# EAGLE schematic SingleSystem (EAGLE 7.5.0)
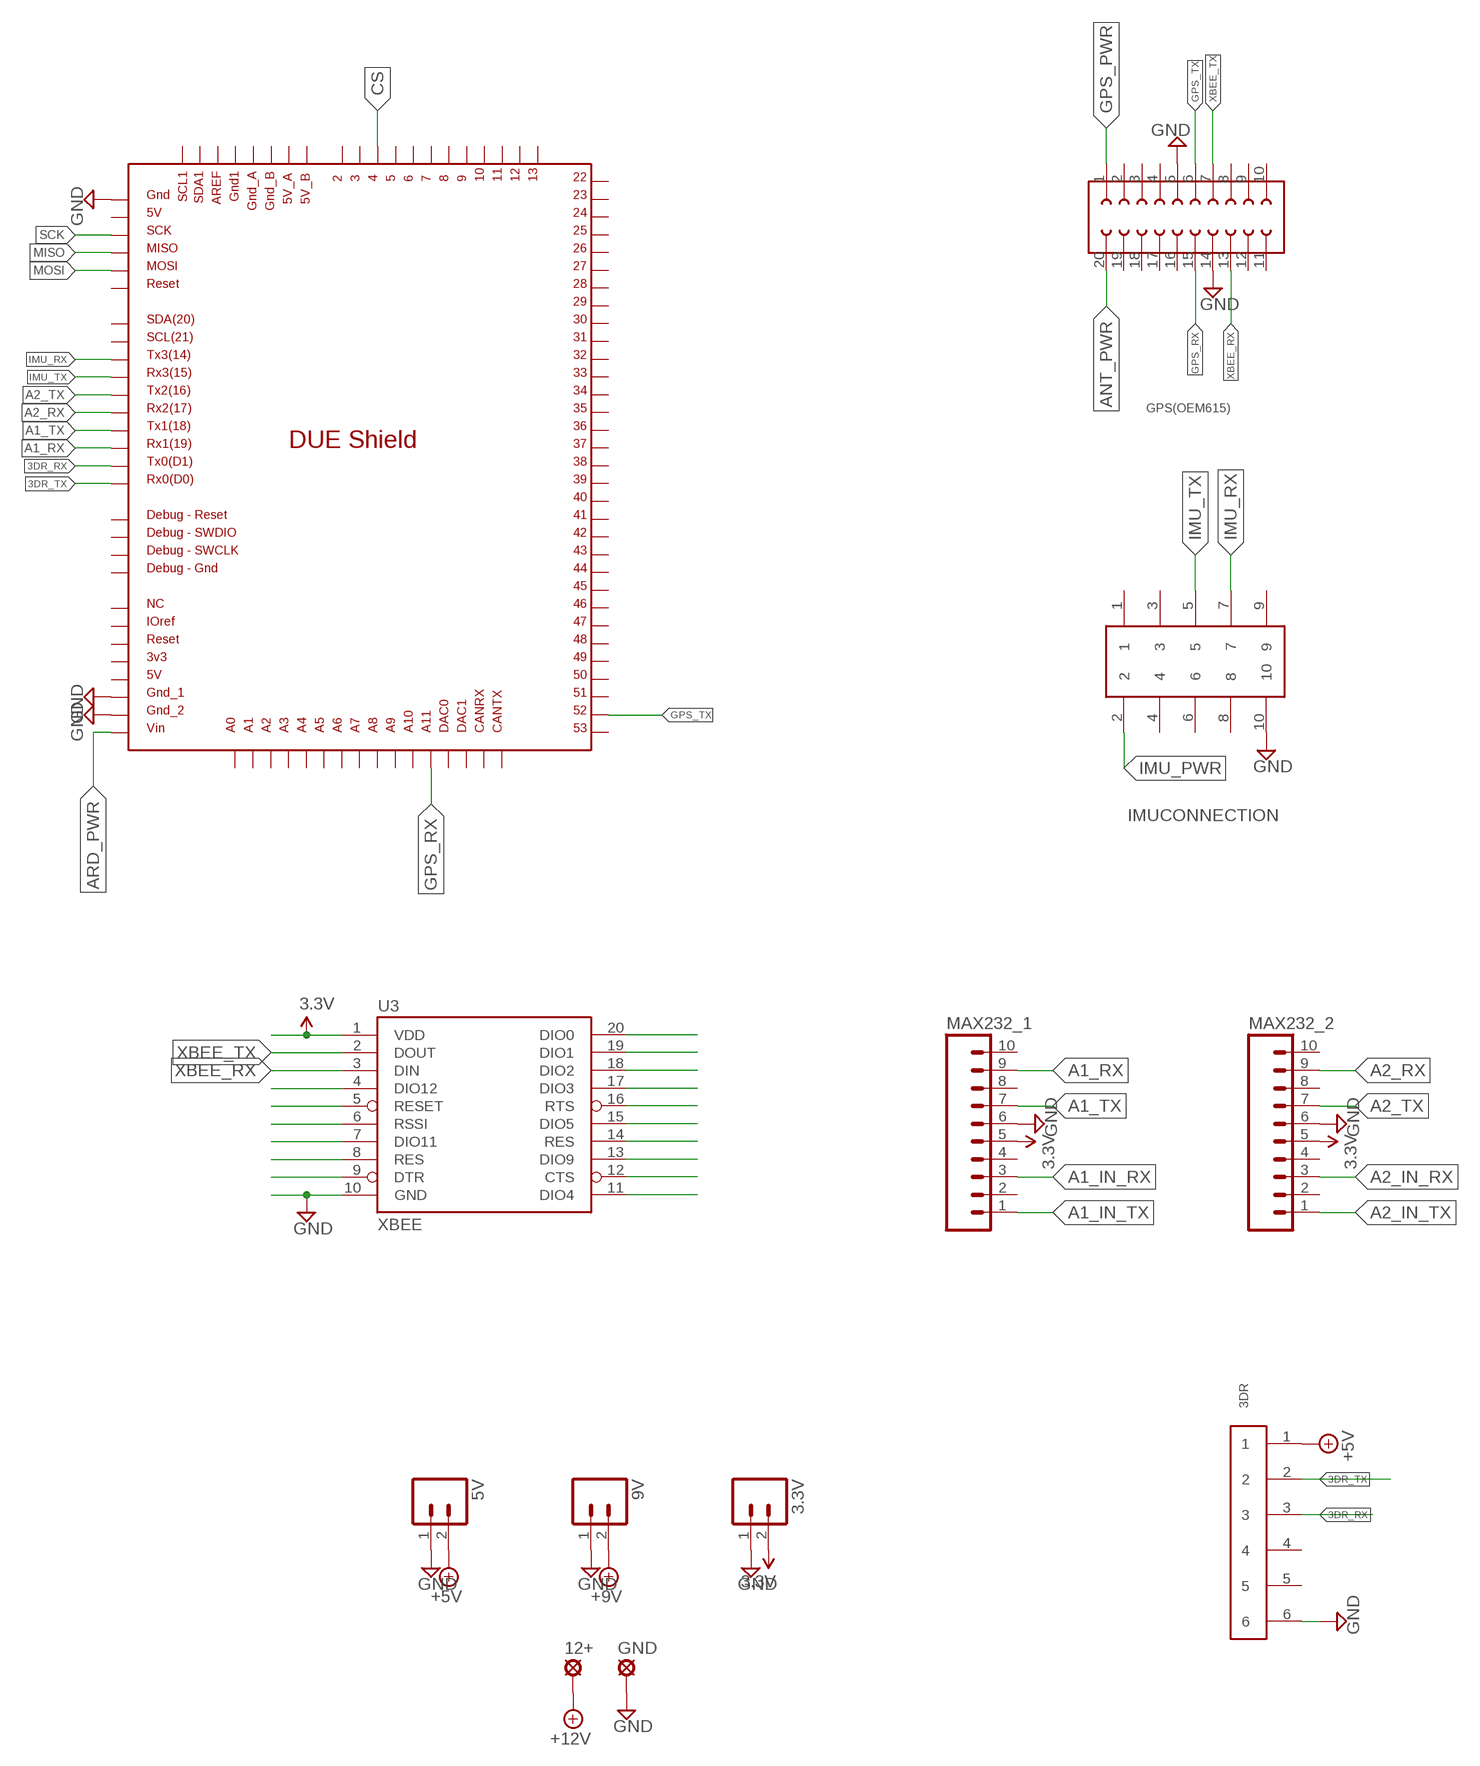
[diagram p0: schematic, sheet 1, part 1 of 2]
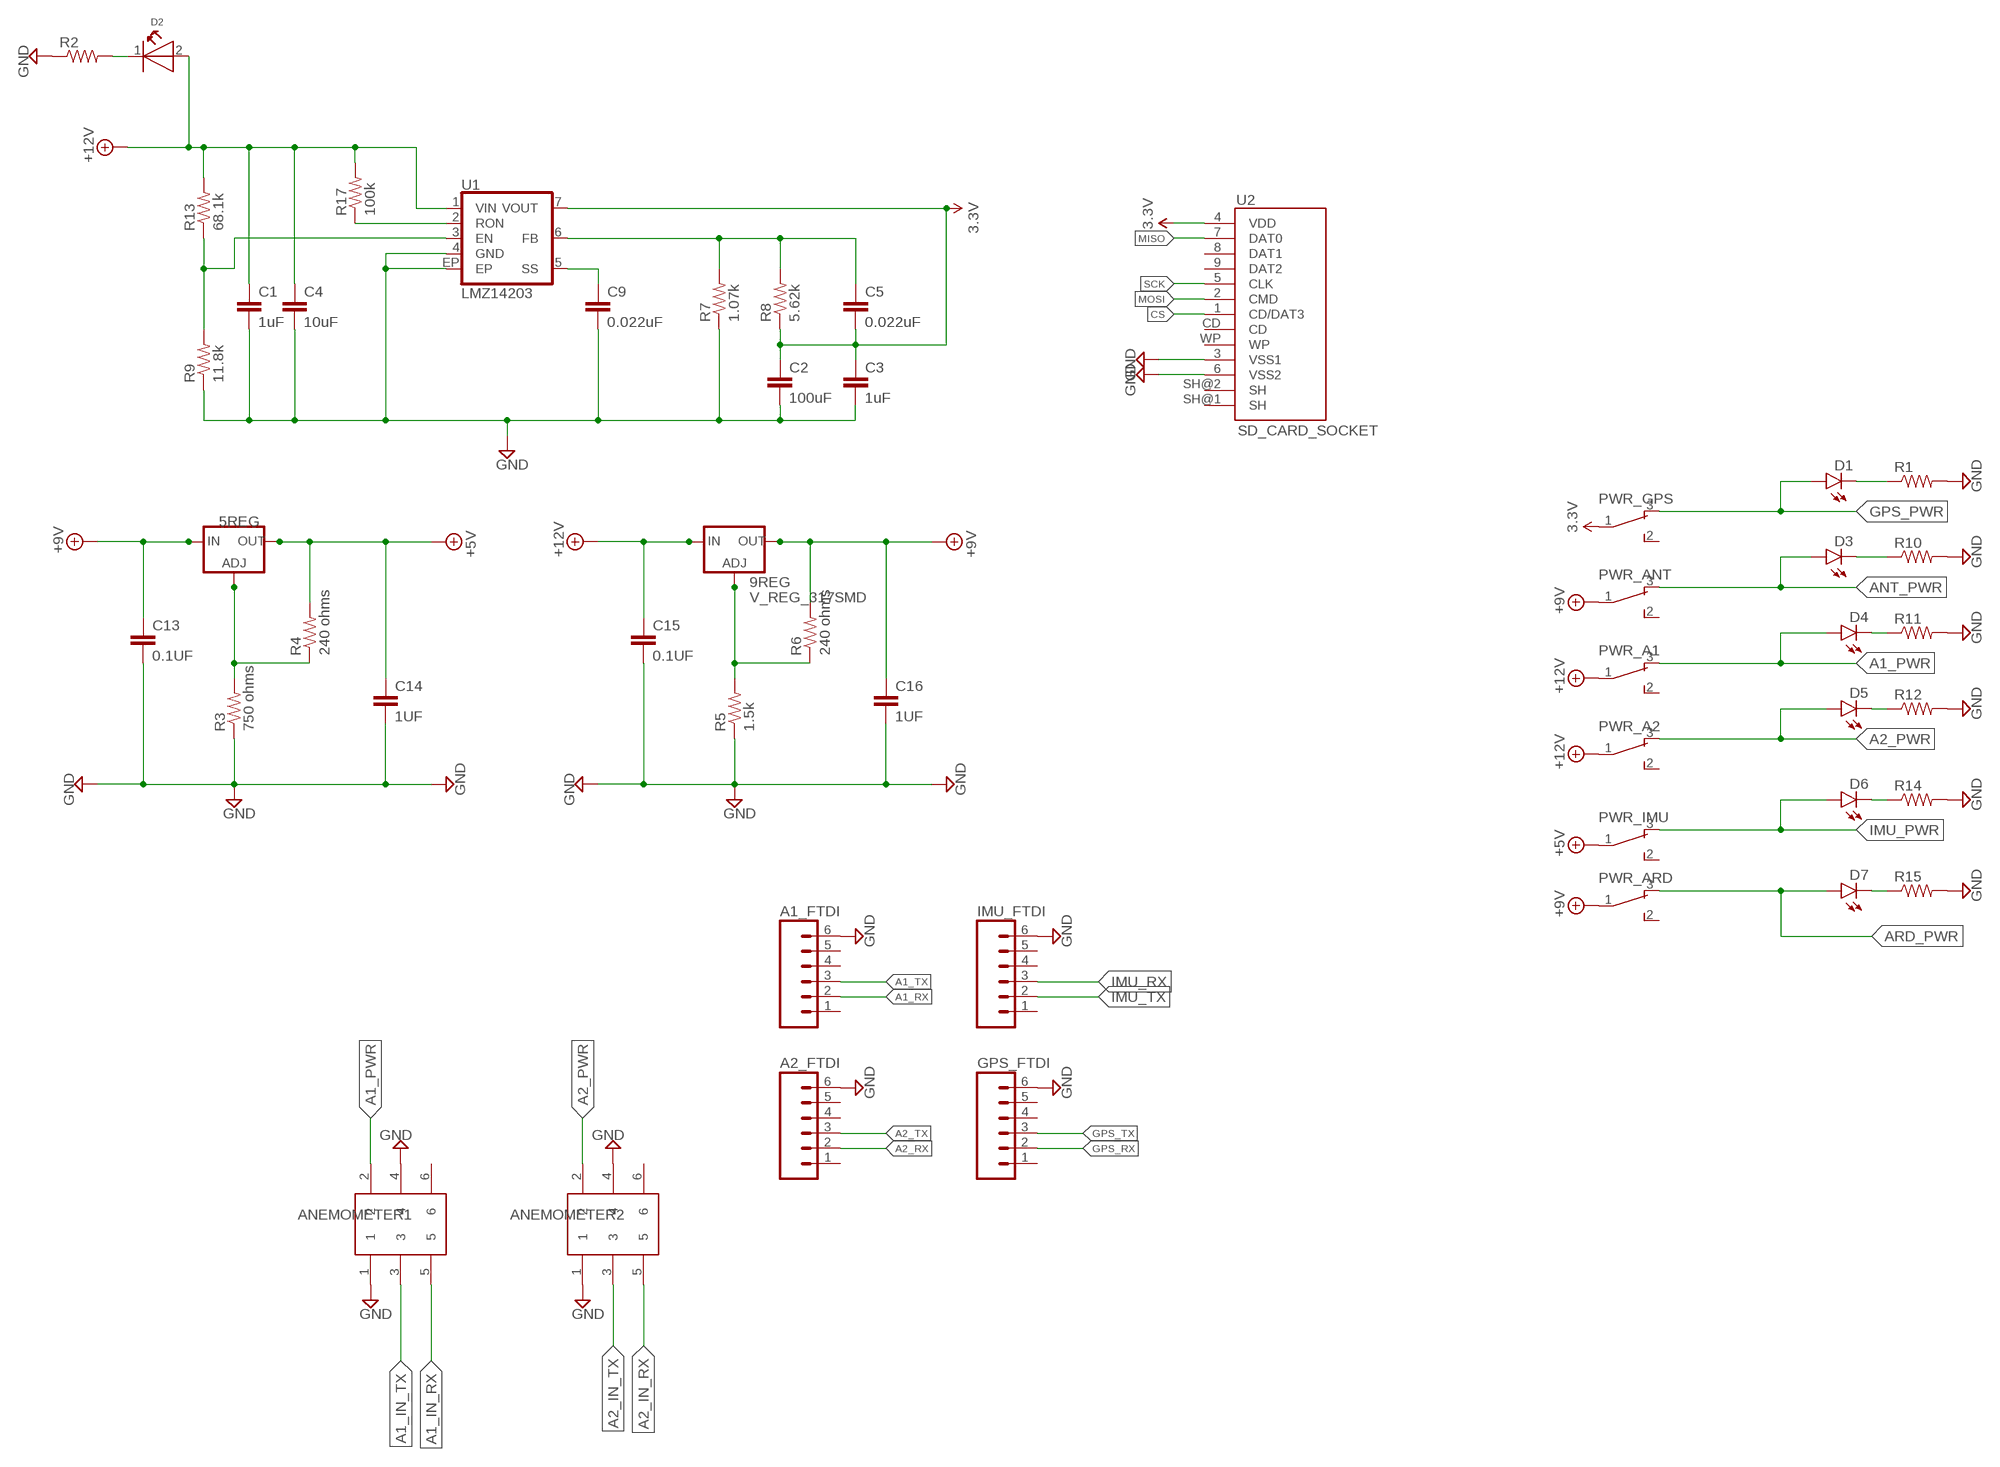
[diagram p1: schematic, sheet 1, part 2 of 2]

## Parts
3.3V  M02  [02P]
3DR  653006114822  [653006114822]
5REG  V_REG_317SMD  [SOT223]
5V  M02  [02P]
9REG  V_REG_317SMD  [SOT223]
9V  M02  [02P]
12+  SE14  [SE14]
A1_FTDI  M06  [06P]
A2_FTDI  M06  [06P]
ANEMOMETER1  61200622323  [61200622323]
ANEMOMETER2  61200622323  [61200622323]
C1  1uF  1UF-25V-10%(0805)  [0805]
C2  100uF  CAP1206  [1206]
C3  1uF  1UF-25V-10%(0805)  [0805]
C4  10uF  CAP0805  [0805]
C5  0.022uF  CAP0603-CAP  [0603-CAP]
C9  0.022uF  CAP0603-CAP  [0603-CAP]
C13  0.1UF  1UF-25V-10%(0805)  [0805]
C14  1UF  1UF-25V-10%(0805)  [0805]
C15  0.1UF  1UF-25V-10%(0805)  [0805]
C16  1UF  1UF-25V-10%(0805)  [0805]
D1  LED-FKIT-1206  [FKIT-LED-1206]
D2  WL-SMCW-150120BS75000-B  [1206]
D3  LED-FKIT-1206  [FKIT-LED-1206]
D4  LED-FKIT-1206  [FKIT-LED-1206]
D5  LED-FKIT-1206  [FKIT-LED-1206]
D6  LED-FKIT-1206  [FKIT-LED-1206]
D7  LED-FKIT-1206  [FKIT-LED-1206]
GND  SE14  [SE14]
GPS(OEM615)  62002021821  [62002021821]
GPS_FTDI  M06  [06P]
IMU_FTDI  M06  [06P]
IMUCONNECTION  62501021621  [62501021621]
MAX232_1  M10  [10P]
MAX232_2  M10  [10P]
PWR_A1  450301014042  [450301014042]
PWR_A2  450301014042  [450301014042]
PWR_ANT  450301014042  [450301014042]
PWR_ARD  450301014042  [450301014042]
PWR_GPS  450301014042  [450301014042]
PWR_IMU  450301014042  [450301014042]
R1  R-US_M2012  [M2012]
R2  R-US_M2012  [M2012]
R3  750 ohms  R-US_M2012  [M2012]
R4  240 ohms  R-US_M2012  [M2012]
R5  1.5k  R-US_M2012  [M2012]
R6  240 ohms  R-US_M2012  [M2012]
R7  1.07k  R-US_M2012  [M2012]
R8  5.62k  R-US_M2012  [M2012]
R9  11.8k  R-US_M2012  [M2012]
R10  R-US_M2012  [M2012]
R11  R-US_M2012  [M2012]
R12  R-US_M2012  [M2012]
R13  68.1k  R-US_M2012  [M2012]
R14  R-US_M2012  [M2012]
R15  R-US_M2012  [M2012]
R17  100k  R-US_M2012  [M2012]
U1  LMZ14203  [TO-PMOD-7]
U2  SD_CARD_SOCKET  [SD_1:1]
U3  XBEE  XBEE-1B1  [XBEE-1]
U$1  DUE(NORMAL)  [DUE(NORMAL)]

## Nets
3.3V: 3.3V.2 C2.1 C3.1 C5.2 MAX232_1.5 MAX232_2.5 PWR_GPS.1 R8.1 U1.7(VOUT) U2.4(VDD) U3.1(VDD)
3DR_RX [3DR]: 3DR.3 U$1.TX0
3DR_TX [3DR]: 3DR.2 U$1.RX0
+5V: 3DR.1 5REG.2(OUT) 5V.2 C14.1 PWR_IMU.1 R4.2
+9V: 5REG.3(IN) 9REG.2(OUT) 9V.2 C13.1 C16.1 PWR_ANT.1 PWR_ARD.1 R6.2
+12V: 9REG.3(IN) 12+.MP C1.1 C4.1 C15.1 D2.2(A) PWR_A1.1 PWR_A2.1 R13.2 R17.2 U1.1(VIN)
A1_IN_RX: ANEMOMETER1.5 MAX232_1.3
A1_IN_TX: ANEMOMETER1.3 MAX232_1.1
A1_PWR: ANEMOMETER1.2 D4.A PWR_A1.3
A1_RX: A1_FTDI.2 MAX232_1.9 U$1.RX1
A1_TX: A1_FTDI.3 MAX232_1.7 U$1.TX1
A2_IN_RX: ANEMOMETER2.5 MAX232_2.3
A2_IN_TX: ANEMOMETER2.3 MAX232_2.1
A2_PWR: ANEMOMETER2.2 D5.A PWR_A2.3
A2_RX: A2_FTDI.2 MAX232_2.9 U$1.RX2
A2_TX: A2_FTDI.3 MAX232_2.7 U$1.TX2
ANT_PWR: D3.A GPS(OEM615).20 PWR_ANT.3
ARD_PWR: D7.A PWR_ARD.3 U$1.VIN
CS: U2.1(CD/DAT3) U$1.4
GND: 3.3V.1 3DR.6 5V.1 9V.1 A1_FTDI.6 A2_FTDI.6 ANEMOMETER1.1 ANEMOMETER1.4 ANEMOMETER2.1 ANEMOMETER2.4 C1.2 C2.2 C3.2 C4.2 C9.2 C13.2 C14.2 C15.2 C16.2 GND.MP GPS(OEM615).5 GPS(OEM615).14 GPS_FTDI.6 IMU_FTDI.6 IMUCONNECTION.10 MAX232_1.6 MAX232_2.6 R1.2 R2.1 R3.1 R5.1 R7.1 R9.1 R10.2 R11.2 R12.2 R14.2 R15.2 U1.4(GND) U1.EP U2.3(VSS1) U2.6(VSS2) U3.10(GND) U$1.5V_ICSP U$1.GND_1 U$1.GND_2
GPS_PWR: D1.A GPS(OEM615).1 PWR_GPS.3
GPS_RX: GPS(OEM615).15 GPS_FTDI.2 U$1.A11
GPS_TX: GPS(OEM615).6 GPS_FTDI.3 U$1.52
IMU_PWR: D6.A IMUCONNECTION.2 PWR_IMU.3
IMU_RX: IMU_FTDI.3 IMUCONNECTION.7 U$1.TX3
IMU_TX: IMU_FTDI.2 IMUCONNECTION.5 U$1.RX3
MISO: U2.7(DAT0) U$1.MISO_ICSP
MOSI: U2.2(CMD) U$1.MOSI_ICSP
N$1: U3.5(RESET)
N$2: 5REG.1(ADJ) R3.2 R4.1
N$3: 9REG.1(ADJ) R5.2 R6.1
N$4: R9.2 R13.1 U1.3(EN)
N$5: R17.1 U1.2(RON)
N$6: C9.1 U1.5(SS)
N$7: D2.1(K) R2.2
N$8: C5.1 R7.2 R8.2 U1.6(FB)
N$9: D1.C R1.1
N$10: D3.C R10.1
N$11: D4.C R11.1
N$12: D5.C R12.1
N$13: D6.C R14.1
N$15: D7.C R15.1
N$24: U3.4(DIO12)
N$26: U3.6(RSSI)
N$27: U3.7(DIO11)
N$28: U3.8(RES)
N$29: U3.9(DTR)
N$31: U3.11(DIO4)
N$32: U3.12(CTS)
N$33: U3.13(DIO9)
N$34: U3.14(RES)
N$35: U3.15(DIO5)
N$36: U3.16(RTS)
N$37: U3.17(DIO3)
N$38: U3.18(DIO2)
N$39: U3.19(DIO1)
N$40: U3.20(DIO0)
SCK: U2.5(CLK) U$1.SCK_ICSP
XBEE_RX: GPS(OEM615).13 U3.3(DIN)
XBEE_TX: GPS(OEM615).7 U3.2(DOUT)
Unconnected: 3DR.4 3DR.5 A1_FTDI.1 A1_FTDI.4 A1_FTDI.5 A2_FTDI.1 A2_FTDI.4 A2_FTDI.5 ANEMOMETER1.6 ANEMOMETER2.6 GPS(OEM615).2 GPS(OEM615).3 GPS(OEM615).4 GPS(OEM615).8 GPS(OEM615).9 GPS(OEM615).10 GPS(OEM615).11 GPS(OEM615).12 GPS(OEM615).16 GPS(OEM615).17 GPS(OEM615).18 GPS(OEM615).19 GPS_FTDI.1 GPS_FTDI.4 GPS_FTDI.5 IMU_FTDI.1 IMU_FTDI.4 IMU_FTDI.5 IMUCONNECTION.1 IMUCONNECTION.3 IMUCONNECTION.4 IMUCONNECTION.6 IMUCONNECTION.8 IMUCONNECTION.9 MAX232_1.2 MAX232_1.4 MAX232_1.8 MAX232_1.10 MAX232_2.2 MAX232_2.4 MAX232_2.8 MAX232_2.10 PWR_A1.2 PWR_A2.2 PWR_ANT.2 PWR_ARD.2 PWR_GPS.2 PWR_IMU.2 U2.8(DAT1) U2.9(DAT2) U2.CD U2.SH@1(SH) U2.SH@2(SH) U2.WP U$1.2 U$1.3 U$1.3V3 U$1.5 U$1.5V U$1.5V_A U$1.5V_B U$1.6 U$1.7 U$1.8 U$1.9 U$1.10 U$1.11 U$1.12 U$1.13 U$1.22 U$1.23 U$1.24 U$1.25 U$1.26 U$1.27 U$1.28 U$1.29 U$1.30 U$1.31 U$1.32 U$1.33 U$1.34 U$1.35 U$1.36 U$1.37 U$1.38 U$1.39 U$1.40 U$1.41 U$1.42 U$1.43 U$1.44 U$1.45 U$1.46 U$1.47 U$1.48 U$1.49 U$1.50 U$1.51 U$1.53 U$1.A0 U$1.A1 U$1.A2 U$1.A3 U$1.A4 U$1.A5 U$1.A6 U$1.A7 U$1.A8 U$1.A9 U$1.A10 U$1.AREF U$1.CANRX U$1.CANTX U$1.DAC0 U$1.DAC1 U$1.GND1 U$1.GND_A U$1.GND_B U$1.GND_DEBUG U$1.GND_ICSP U$1.IOREF U$1.NC U$1.RESET U$1.RESET_DEBUG U$1.RESET_ICSP U$1.SCL U$1.SCL1 U$1.SDA U$1.SDA1 U$1.SWCLK_DEBUG U$1.SWDIO_DEBUG

## Library data of the parts
3.3V 5V 9V = con-amp-quick:M02: AMP QUICK CONNECTOR; OC_FARNELL: unknown; OC_NEWARK: unknown
3DR = Wire_to_Board_Connectors_rev15d:653006114822: WR-WTB 1.25mm Male Vertical Shrouded Header,6 Pins=>Code : Con_WTB_1.25_PCB_THT_653006114822 <http://katalog.we-online.de/media/thumbs2/eican/thb_Con_WTB_1.25_PCB_THT_6530xx114822_pf2.jpg> Details see: http://katalog.we-online.de/en/em/653_0xx_114_822 Created 2014-06-06, Karrer Zheng 2014 (C) Würth Elektronik; OC_NEWARK: unknown
5REG 9REG = SparkFun-PowerIC:V_REG_317: Voltage Regulator Standard LM317 adjustable voltage regulator. AOI (Adjust Output Input). Google 'LM317 Calculator' for easy to use app to get the two resistor values needed. 240/720 for 5V output. 240/390 for 3.3V output. Spark Fun Electronics SKU : COM-00527; OC_NEWARK: unknown
12+ GND = solpad:SE14: SOLDER PAD E1553, drill 1,4mm, distributor Buerklin, 07F820; OC_NEWARK: unknown
A1_FTDI A2_FTDI GPS_FTDI IMU_FTDI = con-amp-quick:M06: AMP QUICK CONNECTOR; OC_FARNELL: unknown; OC_NEWARK: unknown
ANEMOMETER1 ANEMOMETER2 = Wurth_Elektronik_Electromechanic_Wire_to_Board_Connectors_rev15c:61200622323: WR-BHD 2.54mm Board to Cable Transition Connector, 6 Pins=>Code : Con_WTB_IDC_61200622323 <http://katalog.we-online.de/media/thumbs2/eican/thb_Con_WTB_IDC_6120xx22323_pf2.jpg> Details see: http://katalog.we-online.de/en/em/612_0xx_223_23 Created 2014-06-05, Karrer Zheng 2014 (C) Würth Elektronik; OC_NEWARK: unknown
C1 C3 = SparkFun-Capacitors:1UF-25V-10%(0805): CAP-08064; MF: VISHAY/SPRAGUE; MPN: 1C10Z5U104M050R; OC_NEWARK: 66C6034; PROD_ID: CAP-08064
C2 C4 C5 C9 = SparkFun-Capacitors:CAP: Capacitor Standard 0603 ceramic capacitor, and 0.1" leaded capacitor.; OC_NEWARK: unknown
C13-C16 = SparkFun-Capacitors:1UF-25V-10%(0805): CAP-08064; OC_NEWARK: unknown; PROD_ID: CAP-08064; VALUE: 1uF
D1 D3-D7 = SparkFun-LED:LED: LEDs Standard schematic elements and footprints for 5mm, 3mm, 1206, and 0603 sized LEDs. 5mm - Spark Fun Electronics SKU : COM-00529 (and others)
D2 = Wuerth_Elektronik_LEDs_rev15b:WL-SMCW: SMD mono-color Chip LED Characteristics Low energy consumption High reliability Low current requirement Fast switching No UV/IR radiation Smallest SMD package with exceptional brightness Top view Wide viewing angle PBC high-usage Applications Backlight for mobile and portable device keypads Indoor and outdoor message boards Flat backlight for LCDs, switches and symbols Display for industrial control systems and traffic Miniaturized color effects Pedestrian mark Optical indicators General lighting Toys <http://katalog.we-online.de/media/images/eipal/WL-SMCW_pf2.jpg> Details see: http://katalog.we-online.de/en/led/WL-SMCW?m Updated 2015-04-10 2015 (C) Wurth Elektronik; COMPANY-URL: http://www.we-online.de; CREATED-BY: Christin Otto; CREATED-DATE: APR 2013; DATASHEET-URL: http://katalog.we-online.de/en/led/WL-SMCW?m=t&sq=smcw&sp=&sp=http%3A%2F%2Fwww.we-online.de%2Fweb%2Fen%2Felectronic_components%2Fsearchpage_PBS.php%3Fsearch%3Dsmcw#vs_t2:2; MANUFACTURER: Würth Elektronik eiSos GmbH; OC_NEWARK: unknown
GPS(OEM615) = Board_to_Board_Connectors_rev15d:62002021821: WR-PHD 2.00mm Dual Socket Header, 20 Pins=>Code : Con_BTB_SHD_2.00_2_62002021821 <http://katalog.we-online.de/media/thumbs2/eican/thb_Con_BTB_SHD_2.00_2_6200xx21821_pf2.jpg> Details see: http://katalog.we-online.de/en/em/620_0xx_218_21 Created 2014-06-03, Karrer Zheng 2014 (C) Würth Elektronik
IMUCONNECTION = Wurth_Elektronik_Electromechanic_Wire_to_Board_Connectors_rev15c:62501021621: WR-BHD 2.00mm Male Box Header, 10 Pins=>Code : Con_WTB_BHD_2.00_Male_THT_62501021621 <http://katalog.we-online.de/media/thumbs2/eican/thb_Con_WTB_BHD_2.00_Male_THT_6250xx21621_pf2.jpg> Details see: http://katalog.we-online.de/en/em/625_0xx_216_21 Created 2014-06-05, Karrer Zheng 2014 (C) Würth Elektronik; OC_NEWARK: unknown
MAX232_1 MAX232_2 = con-amp-quick:M10: AMP QUICK CONNECTOR; OC_FARNELL: unknown; OC_NEWARK: unknown
PWR_A1 PWR_A2 PWR_ANT PWR_ARD PWR_GPS PWR_IMU = Switches_rev16a:450301014042: WS-SHT, 10mm*2.5mm, SPDT, ON-ON, 2.54mm, straight type, THT, Mini Slide Switch, 3 pins
R1 R10-R12 R14 = adafruit:R-US_: RESISTOR, American symbol
R2 R7-R9 R13 R17 = resistor:R-US_: RESISTOR, American symbol; OC_NEWARK: unknown
R3-R6 = adafruit:R-US_: RESISTOR, American symbol; OC_NEWARK: unknown
R15 = resistor:R-US_: RESISTOR, American symbol
U1 = SparkFun-PowerIC:LMZ14203: 3A, Simple Switcher Power Module with 42V Maximum Input; OC_NEWARK: unknown
U2 = SparkFun-Connectors:SD_CARD_SOCKET: SD Memory Card Connector, push-push normal type, CD enable, WP enable
U3 = SparkFun:XBEE-1; OC_NEWARK: unknown
U$1 = DUElib130425:DUE(NORMAL)

## Net classes
0 default: width 0.508 mm, drill 0.508 mm, clearance 0.432 mm
1 3DR: width 0.381 mm, drill 0.381 mm, clearance 0.381 mm